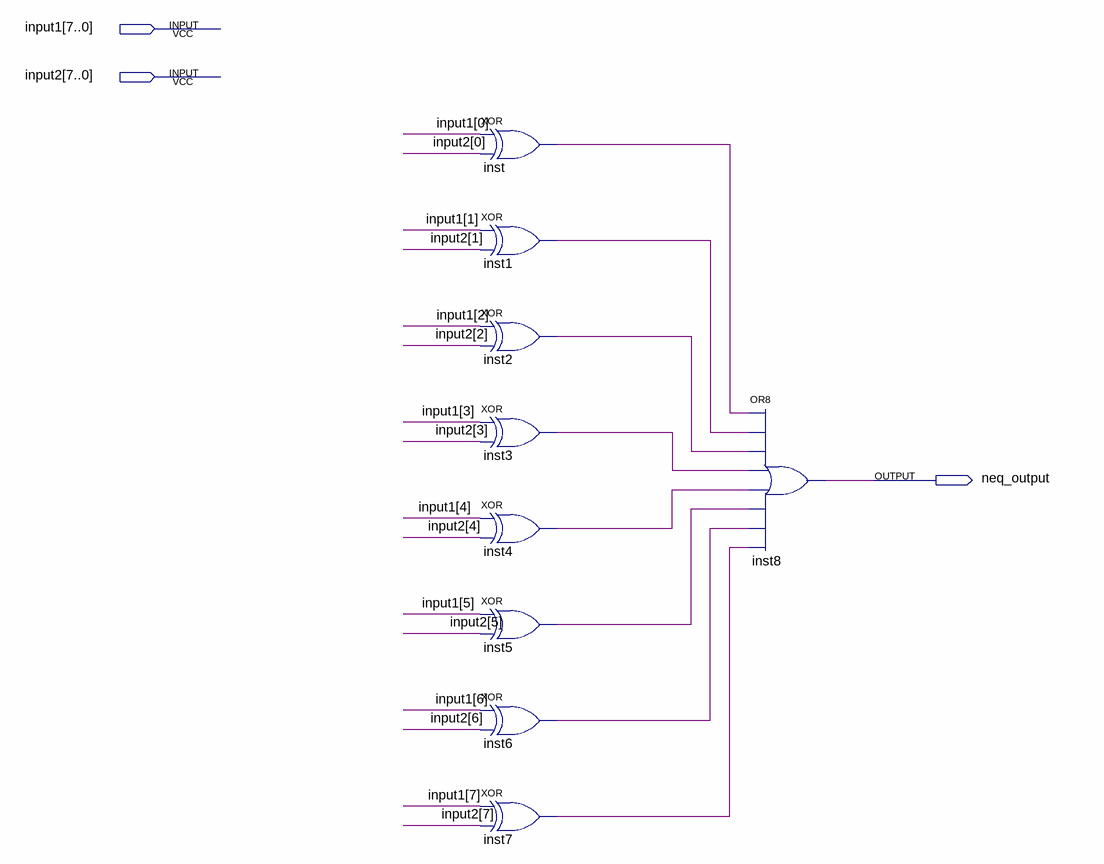
[diagram p0: schematic sheet]
// Quartus schematic NEQ_8bit.bdf as structural Verilog: 9 symbols, 3 pins
module NEQ_8bit (
  input  [7:0] input1,
  input  [7:0] input2,
  output neq_output
);

  wire inst1_out, inst2_out, inst3_out, inst4_out, inst5_out, inst6_out, inst7_out, inst_out;

  xor inst (inst_out, input1[0], input2[0]);
  xor inst1 (inst1_out, input1[1], input2[1]);
  xor inst2 (inst2_out, input1[2], input2[2]);
  xor inst3 (inst3_out, input1[3], input2[3]);
  xor inst4 (inst4_out, input1[4], input2[4]);
  xor inst5 (inst5_out, input1[5], input2[5]);
  xor inst6 (inst6_out, input1[6], input2[6]);
  xor inst7 (inst7_out, input1[7], input2[7]);
  or inst8 (neq_output, inst_out, inst1_out, inst2_out, inst3_out, inst4_out, inst5_out, inst6_out, inst7_out);
endmodule
